# Altium schematic sheet Conversion.SchDoc
size A2; SheetNumber: 4; SheetTotal: 6
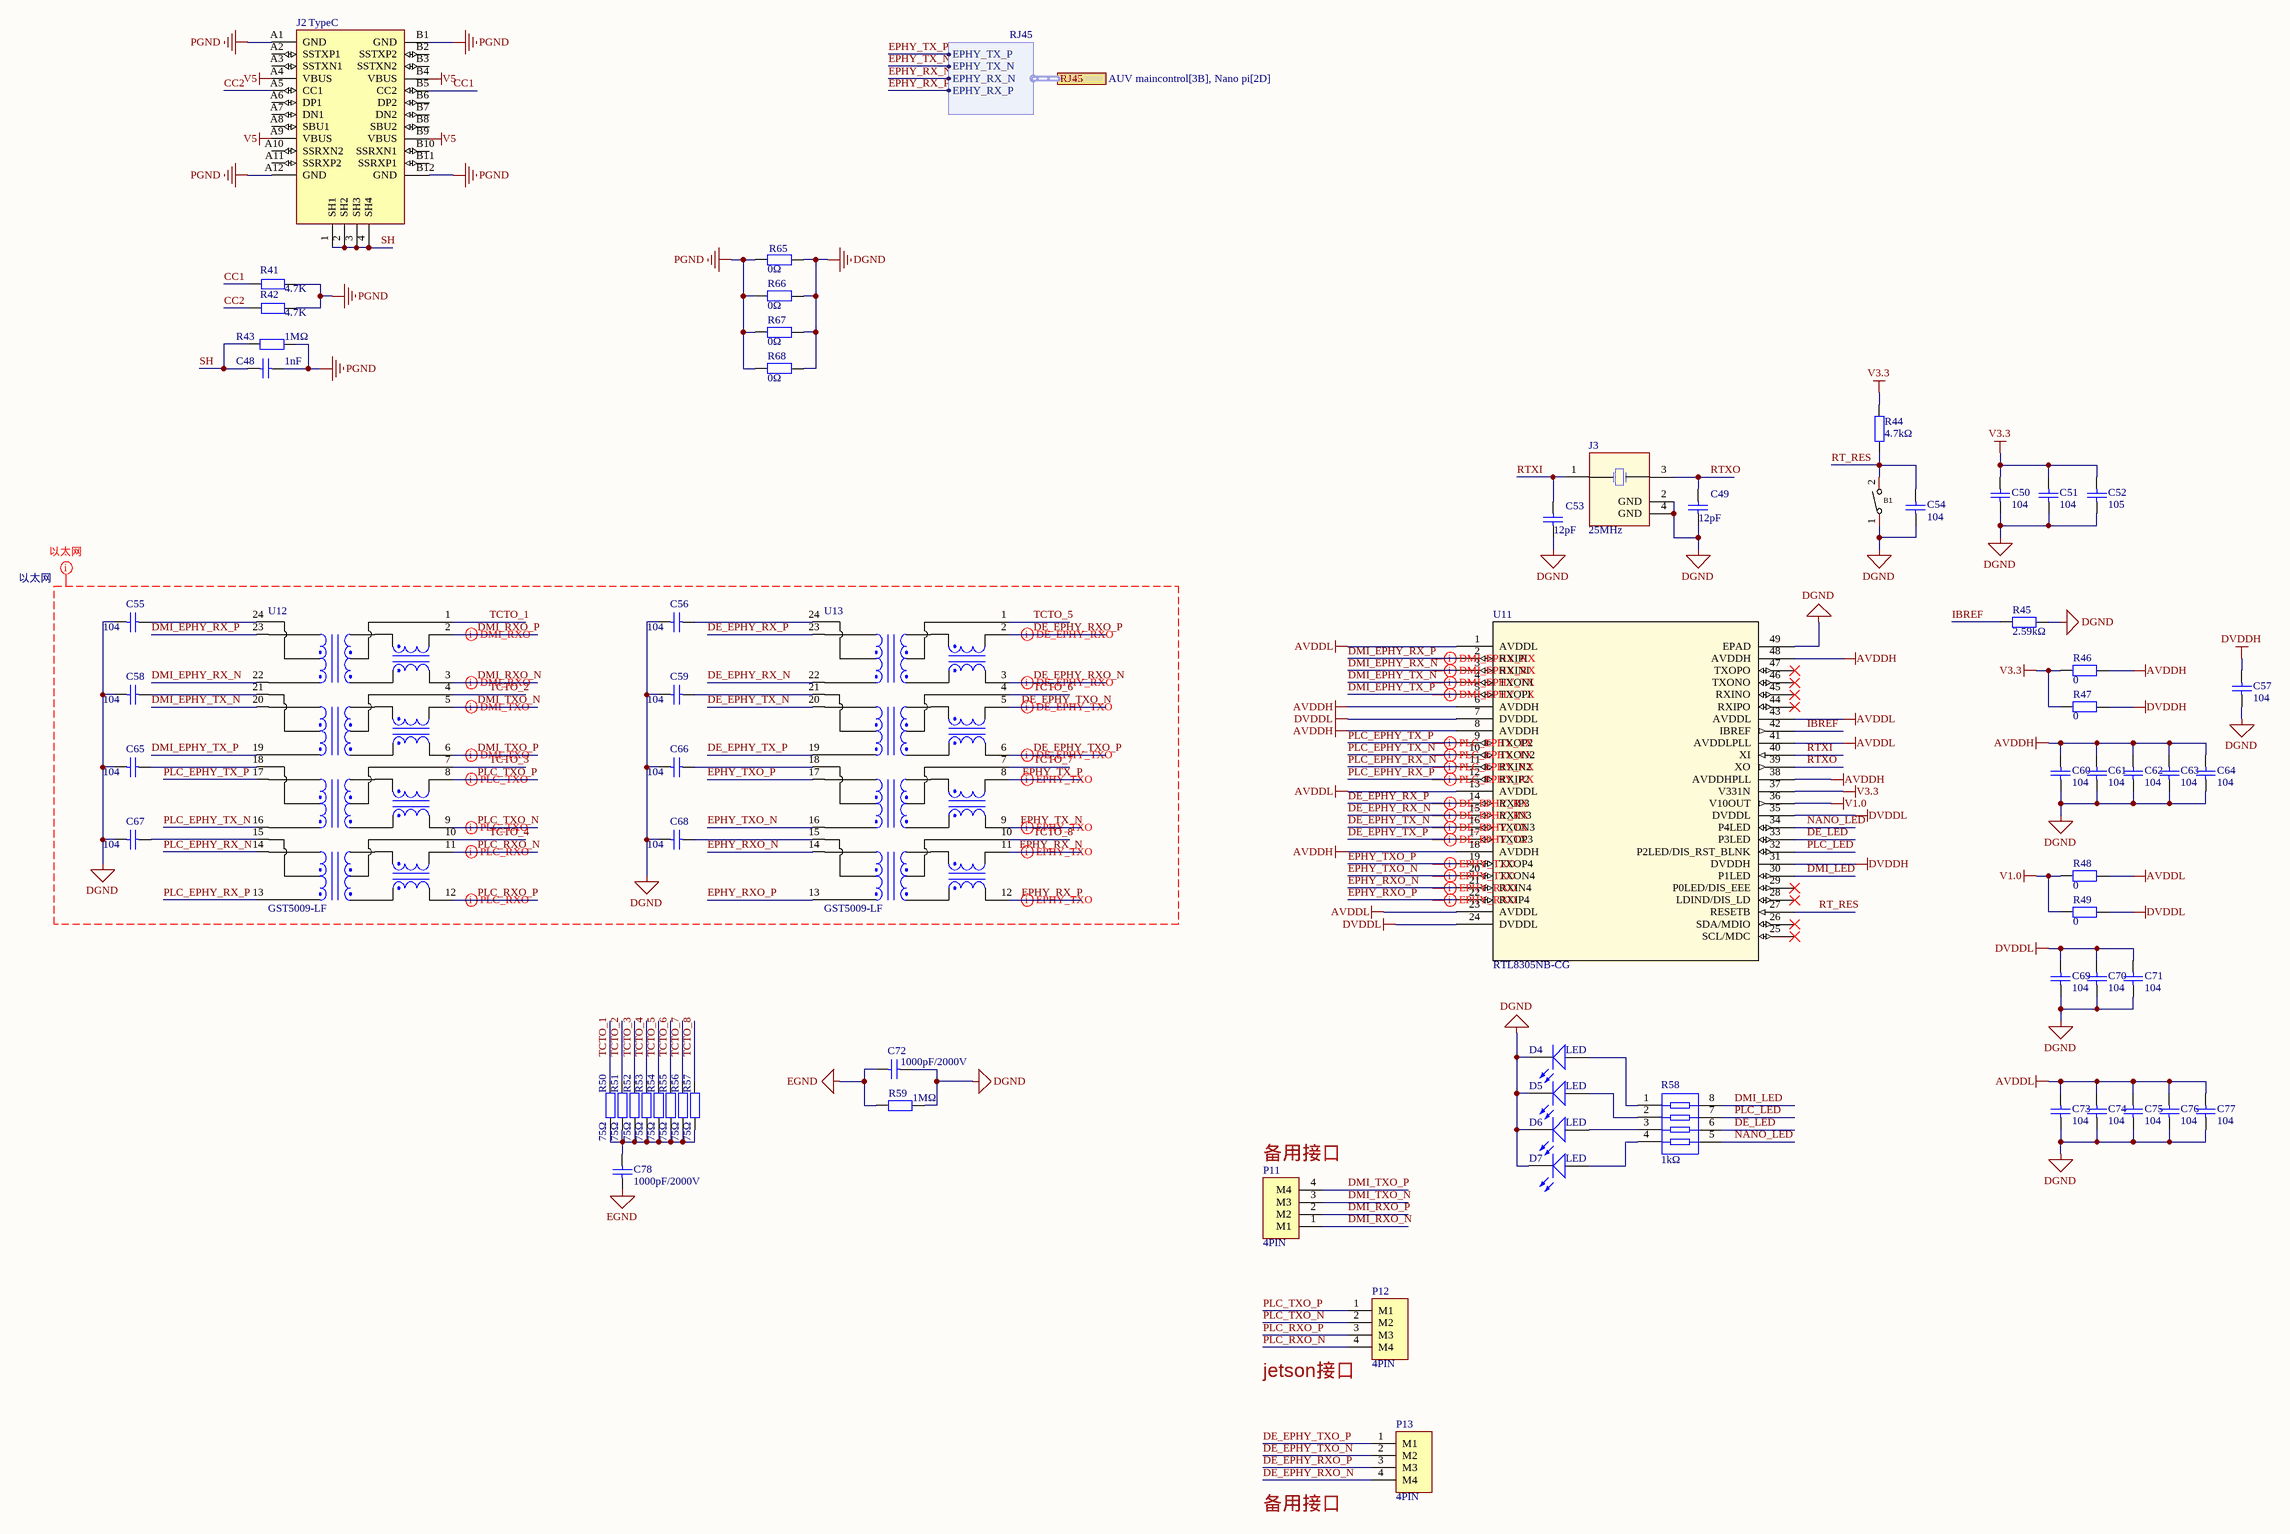
[diagram p0: Conversion.SchDoc]

## Parts
B1  Bottom-2P-1Way  [SW-SMD_L4.0-W2.9-LS5.0]  (value not drawn)
C48  1nF  [1210_C]
C49  12pF  [0603_C]
C50  104  [0402_C]
C51  104  [0402_C]
C52  105  [0402_C]
C53  12pF  [0603_C]
C54  104  [0402_C]
C55  104  [0402_C]
C56  104  [0402_C]
C57  104  [0402_C]
C58  104  [0402_C]
C59  104  [0402_C]
C60  104  [0402_C]
C61  104  [0402_C]
C62  104  [0402_C]
C63  104  [0402_C]
C64  104  [0402_C]
C65  104  [0402_C]
C66  104  [0402_C]
C67  104  [0402_C]
C68  104  [0402_C]
C69  104  [0402_C]
C70  104  [0402_C]
C71  104  [0402_C]
C72  1000pF/2000V  [1210_C]
C73  104  [0402_C]
C74  104  [0402_C]
C75  104  [0402_C]
C76  104  [0402_C]
C77  104  [0402_C]
C78  1000pF/2000V  [1210_C]
D4  LED  [0805_LED]
D5  LED  [0805_LED]
D6  LED  [0805_LED]
D7  LED  [0805_LED]
J2  TypeC  [TYPE-C 16P]
J3  25MHz  [SMD-3225_4P]
P11  4PIN  [MX1.25S-4P]
P12  4PIN  [MX1.25S-4P]
P13  4PIN  [MX1.25S-4P]
R41  4.7K  [0603R]
R42  4.7K  [0603R]
R43  1MΩ  [1206_R]
R44  4.7kΩ  [0402_R]
R45  2.59kΩ  [0402_R]
R46  0  [0402_R]
R47  0  [0402_R]
R48  0  [0402_R]
R49  0  [0402_R]
R50  75Ω  [0402_R]
R51  75Ω  [0402_R]
R52  75Ω  [0402_R]
R53  75Ω  [0402_R]
R54  75Ω  [0402_R]
R55  75Ω  [0402_R]
R56  75Ω  [0402_R]
R57  75Ω  [0402_R]
R58  1kΩ  [0603_Rx4]
R59  1MΩ  [0603_R]
R65  0Ω  [1206_R]
R66  0Ω  [1206_R]
R67  0Ω  [1206_R]
R68  0Ω  [1206_R]
U11  RTL8305NB-CG  [QFN48_RTL8305_RTK-M]
U12  GST5009-LF  [SOP100P1000X400-24N]
U13  GST5009-LF  [SOP100P1000X400-24N]

## Ports
RJ45 (harness RJ45, see AUV maincontrol[3B], Nano pi[2D])

## Harnesses
RJ45: EPHY_TX_P, EPHY_TX_N, EPHY_RX_N, EPHY_RX_P

## Nets
AVDDH: C60.1 C61.1 C62.1 C63.1 C64.1 R46.1 U11.6(AVDDH) U11.8(AVDDH) U11.18(AVDDH) U11.38(AVDDHPLL) U11.48(AVDDH)
AVDDL: C73.1 C74.1 C75.1 C76.1 C77.1 R48.1 U11.1(AVDDL) U11.13(AVDDL) U11.23(AVDDL) U11.41(AVDDLPLL) U11.43(AVDDL)
DGND: B1.1 C49.1 C50.1 C51.1 C52.1 C53.1 C54.1 C55.2 C56.2 C57.2 C58.2 C59.2 C60.2 C61.2 C62.2 C63.2 C64.2 C65.2 C66.2 C67.2 C68.2 C69.2 C70.2 C71.2 C72.1 C73.2 C74.2 C75.2 C76.2 C77.2 D4.K D5.K D6.K D7.K J3.2(GND) J3.4(GND) R45.1 R59.2 R65.2 R66.2 R67.2 R68.2 U11.49(EPAD)
DVDDH: C57.1 R47.1 U11.31(DVDDH)
DVDDL: C69.1 C70.1 C71.1 R49.1 U11.7(DVDDL) U11.24(DVDDL) U11.35(DVDDL)
EGND: C72.2 C78.1 R59.1
PGND: C48.2 J2.A1(GND) J2.A12(GND) J2.B1(GND) J2.B12(GND) R41.2 R42.2 R43.2 R65.1 R66.1 R67.1 R68.1
V1.0: R48.2 R49.2 U11.36(V10OUT)
V3.3: C50.2 C51.2 C52.2 R44.2 R46.2 R47.2 U11.37(V331N)
V5: J2.A4(VBUS) J2.A9(VBUS) J2.B4(VBUS) J2.B9(VBUS)
CC1: J2.B5(CC2) R41.1
CC2: J2.A5(CC1) R42.1
DE_EPHY_RX_N: U11.15(RXIN3) U13.22
DE_EPHY_RX_P: U11.14(RXIP3) U13.23
DE_EPHY_RXO_N: P13.4(M4) U13.3
DE_EPHY_RXO_P: P13.3(M3) U13.2
DE_EPHY_TX_N: U11.16(TXON3) U13.20
DE_EPHY_TX_P: U11.17(TXOP3) U13.19
DE_EPHY_TXO_N: P13.2(M2) U13.5
DE_EPHY_TXO_P: P13.1(M1) U13.6
DE_LED: R58.6 U11.33(P3LED)
DMI_EPHY_RX_N: U11.3(RXINI) U12.22
DMI_EPHY_RX_P: U11.2(RXIPI) U12.23
DMI_EPHY_TX_N: U11.4(TXONI) U12.20
DMI_EPHY_TX_P: U11.5(TXOPI) U12.19
DMI_LED: R58.8 U11.30(P1LED)
DMI_RXO_N: P11.1(M1) U12.3
DMI_RXO_P: P11.2(M2) U12.2
DMI_TXO_N: P11.3(M3) U12.5
DMI_TXO_P: P11.4(M4) U12.6
EPHY_RX_N: U13.11 ; port RJ45.EPHY_RX_N
EPHY_RX_P: U13.12 ; port RJ45.EPHY_RX_P
EPHY_RXO_N: U11.21(RXIN4) U13.14
EPHY_RXO_P: U11.22(RXIP4) U13.13
EPHY_TX_N: U13.9 ; port RJ45.EPHY_TX_N
EPHY_TX_P: U13.8 ; port RJ45.EPHY_TX_P
EPHY_TXO_N: U11.20(TXON4) U13.16
EPHY_TXO_P: U11.19(TXOP4) U13.17
IBREF: R45.2 U11.42(IBREF)
NANO_LED: R58.5 U11.34(P4LED)
PLC_EPHY_RX_N: U11.11(RXIN2) U12.14
PLC_EPHY_RX_P: U11.12(RXIP2) U12.13
PLC_EPHY_TX_N: U11.10(TXON2) U12.16
PLC_EPHY_TX_P: U11.9(TXOP2) U12.17
PLC_LED: R58.7 U11.32(P2LED/DIS_RST_BLNK)
PLC_RXO_N: P12.4(M4) U12.11
PLC_RXO_P: P12.3(M3) U12.12
PLC_TXO_N: P12.2(M2) U12.9
PLC_TXO_P: P12.1(M1) U12.8
RT_RES: B1.2 C54.2 R44.1 U11.27(RESETB)
RTXI: C53.2 J3.1(OSC1) U11.40(XI)
RTXO: C49.2 J3.3(OSC2) U11.39(XO)
SH: C48.1 J2.1(SH1) J2.2(SH2) J2.3(SH3) J2.4(SH4) R43.1
TCTO_1: R50.2 U12.1
TCTO_2: R51.2 U12.4
TCTO_3: R52.2 U12.7
TCTO_4: R53.2 U12.10
TCTO_5: R54.2 U13.1
TCTO_6: R55.2 U13.4
TCTO_7: R56.2 U13.7
TCTO_8: R57.2 U13.10
NetC55_1: C55.1 U12.24
NetC56_1: C56.1 U13.24
NetC58_1: C58.1 U12.21
NetC59_1: C59.1 U13.21
NetC65_1: C65.1 U12.18
NetC66_1: C66.1 U13.18
NetC67_1: C67.1 U12.15
NetC68_1: C68.1 U13.15
NetC78_2: C78.2 R50.1 R51.1 R52.1 R53.1 R54.1 R55.1 R56.1 R57.1
NetD4_A: D4.A R58.1
NetD5_A: D5.A R58.2
NetD6_A: D6.A R58.3
NetD7_A: D7.A R58.4

Not connected (* = marked no-connect by the designer): J2 A2(SSTXP1) A3(SSTXN1) A6(DP1) A7(DN1) A8(SBU1) A10(SSRXN2) A11(SSRXP2) B2(SSTXP2) B3(SSTXN2) B6(DP2) B7(DN2) B8(SBU2) B10(SSRXN1) B11(SSRXP1); U11 25(SCL/MDC)* 26(SDA/MDIO)* 28(LDIND/DIS_LD)* 29(P0LED/DIS_EEE)* 44(RXIPO)* 45(RXINO)* 46(TXONO)* 47(TXOPO)*

## Layout directives
differential pair: DE_EPHY_RX_N, DE_EPHY_RX_P, DE_EPHY_RXO_N, DE_EPHY_RXO_P, DE_EPHY_TX_N, DE_EPHY_TX_P, DE_EPHY_TXO_N, DE_EPHY_TXO_P, DMI_EPHY_RX_N, DMI_EPHY_RX_P, DMI_EPHY_TX_N, DMI_EPHY_TX_P, DMI_RXO_N, DMI_RXO_P, DMI_TXO_N, DMI_TXO_P, EPHY_RX_N, EPHY_RX_P, EPHY_RXO_N, EPHY_RXO_P, EPHY_TX_N, EPHY_TX_P, EPHY_TXO_N, EPHY_TXO_P, PLC_EPHY_RX_N, PLC_EPHY_RX_P, PLC_EPHY_TX_N, PLC_EPHY_TX_P, PLC_RXO_N, PLC_RXO_P, PLC_TXO_N, PLC_TXO_P
net class 以太网; net class *: DE_EPHY_RX_N, DE_EPHY_RX_P, DE_EPHY_RXO_N, DE_EPHY_RXO_P, DE_EPHY_TX_N, DE_EPHY_TX_P, DE_EPHY_TXO_N, DE_EPHY_TXO_P, DGND, DMI_EPHY_RX_N, DMI_EPHY_RX_P, DMI_EPHY_TX_N, DMI_EPHY_TX_P, DMI_RXO_N, DMI_RXO_P, DMI_TXO_N, DMI_TXO_P, EPHY_RX_N, EPHY_RX_P, EPHY_RXO_N, EPHY_RXO_P, EPHY_TX_N, EPHY_TX_P, EPHY_TXO_N, EPHY_TXO_P, PLC_EPHY_RX_N, PLC_EPHY_RX_P, PLC_EPHY_TX_N, PLC_EPHY_TX_P, PLC_RXO_N, PLC_RXO_P, PLC_TXO_N, PLC_TXO_P, TCTO_1, TCTO_2, TCTO_3, TCTO_4, TCTO_5, TCTO_6, TCTO_7, TCTO_8

## Notes on the sheet
- (near P11) 备用接口
- (near P12) jetson接口
- 备用接口

## Library data of the parts
B1 = Bottom-2P-1Way: 轻触按键; Manufacturer: SHOU HAN(首韩); Symbol: TS342A2P-WZ; Add into BOM: yes; Device: TS342A2P-WZ; LCSC Part Name: 轻触开关 3*4*2 两脚小龟不带柱 250gf 黑色塑胶按钮; Supplier Part: C557591; Manufacturer Part: TS342A2P-WZ; Supplier Footprint: SMD; JLCPCB Part Class: Extended Part; Datasheet: https://atta.szlcsc.com/upload/public/pdf/source/20200519/C557591_B3A5A21584733303F06306F18577DA8B.pdf; Supplier: LCSC; Convert to PCB: yes
C48-C78 = SMT_Cap: 贴片电容; ComponentLink1Description: 供应商链接; ComponentLink1URL: http://www.szlcsc.com/product/details_29010.html; Package: 0805; Supplier: LC; SuppliersPartNumber: C28260
D4-D7 = LED: 发光二极管; ComponentLink1Description: 供应商链接; ComponentLink1URL: http://www.szlcsc.com/product/details_2663.html; Package: 0603; Supplier: LC; SuppliersPartNumber: C2290
J3 = Oscillator_SMT_4P
P11-P13 = 接线端子-4PIN
R41 R42 = Res: 电阻
R43-R57 R59 R65-R68 = SMT_Res: 贴片电阻; ComponentLink1Description: 供应商链接; ComponentLink1URL: http://www.szlcsc.com/product/details_23980.html; Package: 0603; Supplier: LC; SuppliersPartNumber: C23253
R58 = SMT_Res-4: 贴片排阻; ComponentLink1Description: 供应商链接; ComponentLink1URL: http://www.szlcsc.com/product/details_26253.html; Package: 0603*4; Supplier: LC; SuppliersPartNumber: C25510
U11 = RTL8305NB-CG: 10/100M PHY; Mfr_Name: Realtek; Type: DEV; Copyright: Copyright (C) 2023 Ultra Librarian. All rights reserved.; Manufacturer_Part_Number: RTL8305NB-CG; RefDes: RefDes
U12 U13 = GST5009-LF: Network